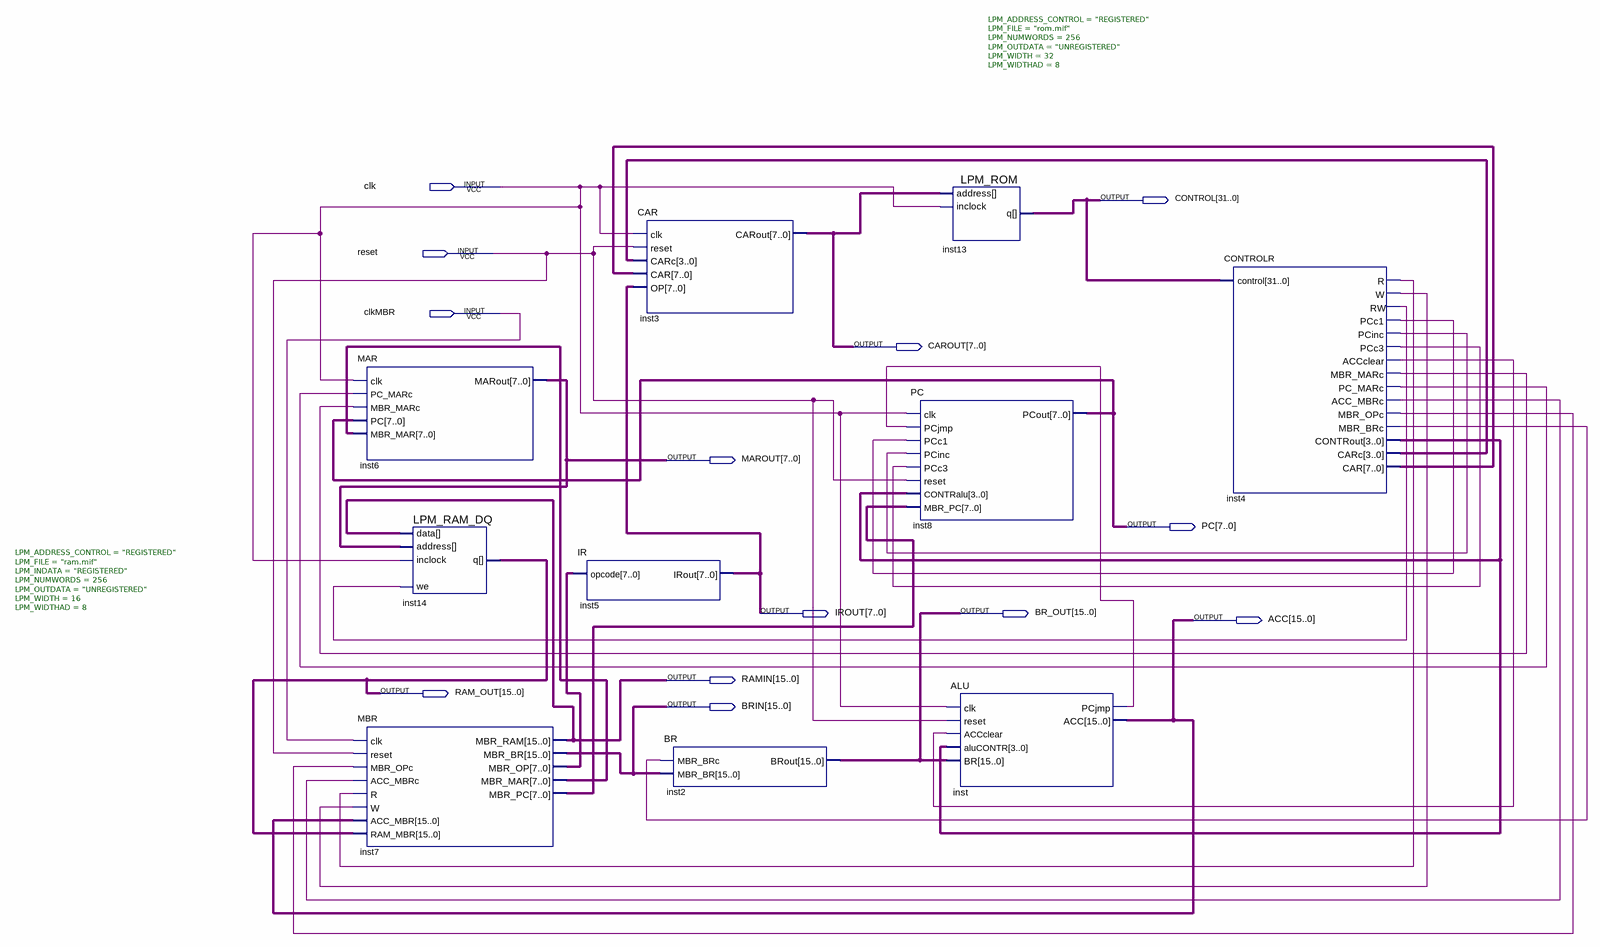
[diagram p0: schematic sheet]
// Quartus schematic f4b.bdf as structural Verilog: 10 symbols, 13 pins
module f4b (
  input  clk,
  input  reset,
  input  clkMBR,
  output [31:0] CONTROL,
  output [7:0] CAROUT,
  output [7:0] MAROUT,
  output [7:0] PC,
  output [7:0] IROUT,
  output [15:0] BR_OUT,
  output [15:0] ACC,
  output [15:0] RAMIN,
  output [15:0] RAM_OUT,
  output [15:0] BRIN
);

  wire inst4_acc_mbrc, inst4_accclear, inst4_mbr_brc, inst4_mbr_marc, inst4_mbr_opc, inst4_pc_marc,
       inst4_pcc1, inst4_pcc3, inst4_pcinc, inst4_r, inst4_rw, inst4_w, inst_pcjmp;
  wire [3:0] inst4_carc, inst4_controut;
  wire [7:0] inst4_car, inst7_mbr_mar, inst7_mbr_op, inst7_mbr_pc;

  MAR inst6 (
    .clk(clk), .PC_MARc(inst4_pc_marc), .MBR_MARc(inst4_mbr_marc), .PC(PC), .MBR_MAR(inst7_mbr_mar),
    .MARout(MAROUT));
  MBR inst7 (
    .clk(clkMBR), .reset(reset), .MBR_OPc(inst4_mbr_opc), .ACC_MBRc(inst4_acc_mbrc), .R(inst4_r),
    .W(inst4_w), .ACC_MBR(ACC), .RAM_MBR(RAM_OUT), .MBR_RAM(RAMIN), .MBR_BR(BRIN), .MBR_OP(inst7_mbr_op),
    .MBR_MAR(inst7_mbr_mar), .MBR_PC(inst7_mbr_pc));
  LPM_RAM_DQ #(.LPM_ADDRESS_CONTROL("REGISTERED"), .LPM_FILE("ram.mif"), .LPM_INDATA("REGISTERED"), .LPM_NUMWORDS(256), .LPM_OUTDATA("UNREGISTERED"), .LPM_WIDTH(16), .LPM_WIDTHAD(8)) inst14 (
    .address(MAROUT), .data(RAMIN), .inclock(clk), .we(inst4_rw), .q(RAM_OUT));
  IR inst5 (.opcode(inst7_mbr_op), .IRout(IROUT));
  CAR inst3 (.clk(clk), .reset(reset), .CARc(inst4_carc), .CAR(inst4_car), .OP(IROUT), .CARout(CAROUT));
  BR inst2 (.MBR_BRc(inst4_mbr_brc), .MBR_BR(BRIN), .BRout(BR_OUT));
  LPM_ROM #(.LPM_ADDRESS_CONTROL("REGISTERED"), .LPM_FILE("rom.mif"), .LPM_NUMWORDS(256), .LPM_OUTDATA("UNREGISTERED"), .LPM_WIDTH(32), .LPM_WIDTHAD(8)) inst13 (
    .address(CAROUT), .inclock(clk), .q(CONTROL));
  PC inst8 (
    .clk(clk), .PCjmp(inst_pcjmp), .PCc1(inst4_pcc1), .PCinc(inst4_pcinc), .PCc3(inst4_pcc3), .reset(reset),
    .CONTRalu(inst4_controut), .MBR_PC(inst7_mbr_pc), .PCout(PC));
  ALU inst (
    .clk(clk), .reset(reset), .ACCclear(inst4_accclear), .aluCONTR(inst4_controut), .BR(BR_OUT),
    .PCjmp(inst_pcjmp), .ACC(ACC));
  CONTROLR inst4 (
    .control(CONTROL), .R(inst4_r), .W(inst4_w), .RW(inst4_rw), .PCc1(inst4_pcc1), .PCinc(inst4_pcinc),
    .PCc3(inst4_pcc3), .ACCclear(inst4_accclear), .MBR_MARc(inst4_mbr_marc), .PC_MARc(inst4_pc_marc),
    .ACC_MBRc(inst4_acc_mbrc), .MBR_OPc(inst4_mbr_opc), .MBR_BRc(inst4_mbr_brc), .CONTRout(inst4_controut),
    .CARc(inst4_carc), .CAR(inst4_car));
endmodule
